# Altium schematic sheet Power_Supply.SchDoc
size A4; Organization: Altium Limited; Address1: L3, 12a Rodborough Rd; Address2: Frenchs Forest; Address3: NSW; Address4: Australia 2086
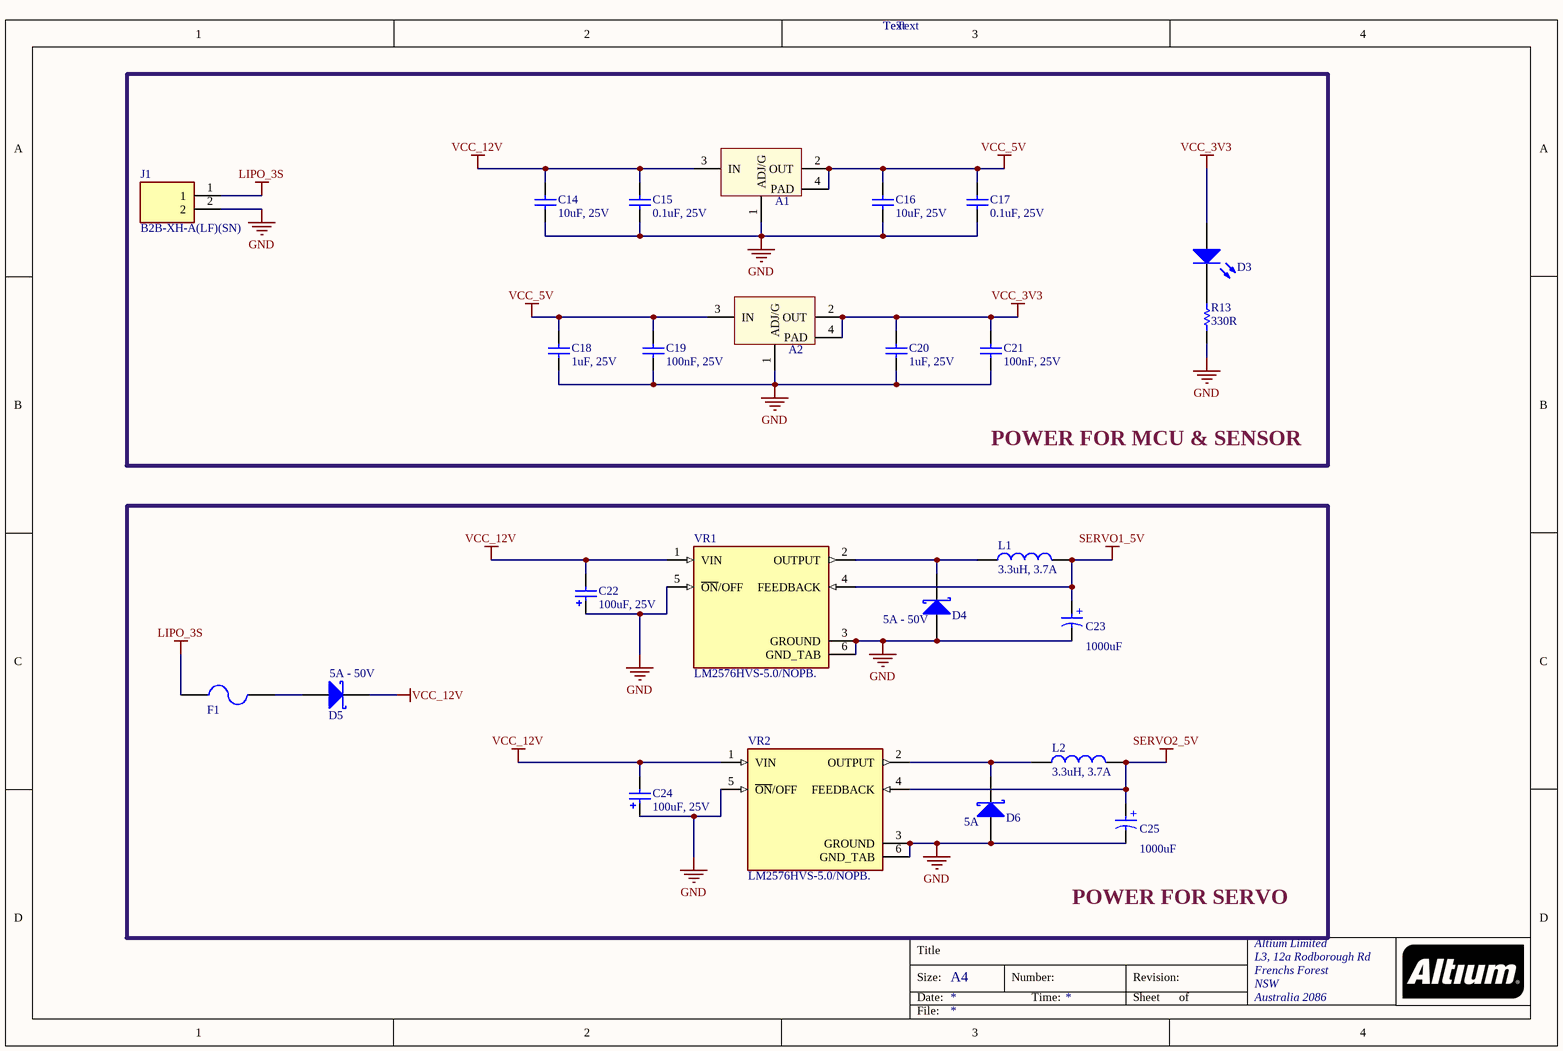
[diagram p0: Power_Supply.SchDoc]

## Parts
A1  LM1117  [SOT223-4N]  (value not drawn)
A2  LM1117  [SOT223-4N]  (value not drawn)
C14  value 10uF, 25V  [CAP-SM-0805]  (hidden comment: Cap Non-Pol SMD)
C15  value 0.1uF, 25V  [CAP-SM-0805]  (hidden comment: Cap Non-Pol SMD)
C16  value 10uF, 25V  [CAP-SM-0805]  (hidden comment: Cap Non-Pol SMD)
C17  value 0.1uF, 25V  [CAP-SM-0805]  (hidden comment: Cap Non-Pol SMD)
C18  value 1uF, 25V  [CAP-SM-0805]  (hidden comment: Cap Non-Pol SMD)
C19  value 100nF, 25V  [CAP-SM-0805]  (hidden comment: Cap Non-Pol SMD)
C20  value 1uF, 25V  [CAP-SM-0805]  (hidden comment: Cap Non-Pol SMD)
C21  value 100nF, 25V  [CAP-SM-0805]  (hidden comment: Cap Non-Pol SMD)
C22  value 100uF, 25V  [CAP ALU SIZE F]  (hidden comment: Cap Pol SMD)
C23  1000uF  [WCAP-ASLI_D12.5H14]  (value not drawn)
C24  value 100uF, 25V  [CAP ALU SIZE F]  (hidden comment: Cap Pol SMD)
C25  1000uF  [WCAP-ASLI_D12.5H14]  (value not drawn)
D3  LED SMD  [LED_0603_Blue]  (value not drawn)
D4  D Schottky  [SS34]  (value not drawn)
D5  D Schottky  [SS34]  (value not drawn)
D6  D Schottky  [SS34]  (value not drawn)
F1  Fuse  [FUSE SMD]  (value not drawn)
J1  B2B-XH-A(LF)(SN)  [JST_B2B-XH-A(LF)(SN)]
L1  3.3uH, 3.7A  [WE-PD2A_5848]
L2  3.3uH, 3.7A  [WE-PD2A_5848]
R13  value 330R  [RES-SM-0805]  (hidden comment: RESISTOR SMD)
VR1  LM2576HVS-5.0/NOPB.  [TO170P1524X483-6N]
VR2  LM2576HVS-5.0/NOPB.  [TO170P1524X483-6N]

## Blocks framed on the sheet
POWER FOR MCU & SENSOR: A1 A2 C14-C21 D3 J1 R13
POWER FOR SERVO: C22-C25 D4-D6 F1 L1 L2 VR1 VR2

## Nets
GND: A1.1(ADJ/G) A2.1(ADJ/G) C14.1 C15.1 C16.1 C17.1 C18.1 C19.1 C20.1 C21.1 C22.1 C23.2(N) C24.1 C25.2(N) D4.1(A) D6.1(A) J1.2 R13.2 VR1.3(GROUND) VR1.5(~{ON}/OFF) VR1.6(GND_TAB) VR2.3(GROUND) VR2.5(~{ON}/OFF) VR2.6(GND_TAB)
LIPO_3S: F1.1 J1.1
SERVO1_5V: C23.1(P) L1.2 VR1.4(FEEDBACK)
SERVO2_5V: C25.1(P) L2.2 VR2.4(FEEDBACK)
VCC_3V3: A2.2(OUT) A2.4(PAD) C20.2 C21.2 D3.1(A)
VCC_5V: A1.2(OUT) A1.4(PAD) A2.3(IN) C16.2 C17.2 C18.2 C19.2
VCC_12V: A1.3(IN) C14.2 C15.2 C22.2 C24.2 D5.2(K) VR1.1(VIN) VR2.1(VIN)
NetD3_2: D3.2(K) R13.1
NetD4_2: D4.2(K) L1.1 VR1.2(OUTPUT)
NetD5_1: D5.1(A) F1.2
NetD6_2: D6.2(K) L2.1 VR2.2(OUTPUT)

## Notes on the sheet
- Text
- (near D4) 5A - 50V
- (near C23) 1000uF
- (near D5) 5A - 50V
- (near D6) 5A
- (near C25) 1000uF
- Title
- Size:
- Date:
- A4
- Number:
- Time:
- Revision:
- Sheet
- of
- File:
- (in symbol 865080462016) +

## Library data of the parts
A1 A2 = LM1117: Available in 1.8V, 2.5V, 2.85V, 3.3V, 5V, and  Adjustable Versions; Value: LM317
C14-C21 = Cap Non-Pol SMD: Capacitor
C22 C24 = Cap Pol SMD: Polarized Capacitor (Radial)
C23 C25 = 865080462016: WCAP-ASLI Aluminum Electrolytic Capacitor, V-Chip, D12.5 x H14mm, 1000uF, 25V; Manufacturer: Wurth Elektronik; Capacitance Tolerance: +/-20%; Dissipation Factor: 14%; Endurance: 5000h; Leakage Current: 250uA; Ripple Current: 1100mA; Technical Reference: ASEH140102M025DVCTGE000; Manufacturer Part Number: 865080462016; Category: Aluminum Electrolytic Capacitors; Match Code: WCAP-ASLI; ComponentLink1Description: Website Link; ComponentLink1URL: https://www.we-online.com/redexpert/article/865080462016?ad; ComponentLink2Description: Datasheet Link; ComponentLink2URL: https://www.we-online.com/redexpert/spec/865080462016?ad; Mount: Surface Mount; Operating Temperature Max: 105°C; Operating Temperature Min: -55°C; Packaging: Tape and Reel; Height: 14mm; Diameter: 12.5mm; Capacitance: 1000uF; Rated Voltage (DC): 25V
D3 = LED SMD: LED
D4-D6 = D Schottky: Schottky Diode; Published: 8-Jun-2000; LatestRevisionDate: 17-Jul-2002; LatestRevisionNote: Re-released for DXP Platform.; PackageReference: SMB; Publisher: Altium Limited; PackageDescription: DO-214-AA/SMB; 2 C-Bend Leads; Body 5.3 x 3.6 mm, inc. leads (LxW); Code_JEDEC: DO-214-AA
J1 = B2B-XH-A(LF)(SN): Connector Header Through Hole 2 position 0.098 (2.50mm); MF: JST Sales; Value: *; MP: B2B-XH-A(LF)(SN); Purchase-URL: https://pricing.snapeda.com/search/part/B2B-XH-A(LF)(SN)/?ref=eda; Availability: In Stock; Price: None; Package: None
L1 L2 = 784774033: WE-PD2A SMT Power Inductor, size 5848, 3.3uH, 3.7A; Manufacturer: Wurth Elektronik; DC Resistance max.: 0.06Ohm; Saturation Current: 7.5A; Self Resonant Frequency: 43MHz; DC Resistance typ.: 0.042Ohm; Rated Voltage: 80VDC; ComponentLink1Description: Manufacturer; ComponentLink1URL: http://www.we-online.de; ComponentLink2Description: Datasheet; ComponentLink2URL: https://www.we-online.com/catalog/datasheet/784774033.pdf; Manufacturer Part Number: 784774033; Published Date: May 2020; Rated Current: 3.7A; Inductance: 3.3uH; Operating Temperature: -40 to +125degC; Mounting Technology: SMT; Packaging: Tape and Reel; Size: 5848
R13 = RESISTOR SMD: Resistor
VR1 VR2 = LM2596S-5.0: SIMPLE SWITCHER&reg; 4.5V to 40V, 3A Low Component Count Step-Down Regulator; MP: LM2596S-5.0/NOPB; MF: Texas Instruments; Price: None; Availability: In Stock; Package: TO-263-5 Texas Instruments; SnapEDA_Link: https://www.snapeda.com/parts/LM2596S-5.0/NOPB/Texas+Instruments/view-part/?ref=snap; Check_prices: https://www.snapeda.com/parts/LM2596S-5.0/NOPB/Texas+Instruments/view-part/?ref=eda; Value: *; Purchase-URL: https://pricing.snapeda.com/search/part/LM2596S-5.0/NOPB/?ref=eda